# EAGLE design NodeIrTranceiver.v1.cg2 (EAGLE 4.11)
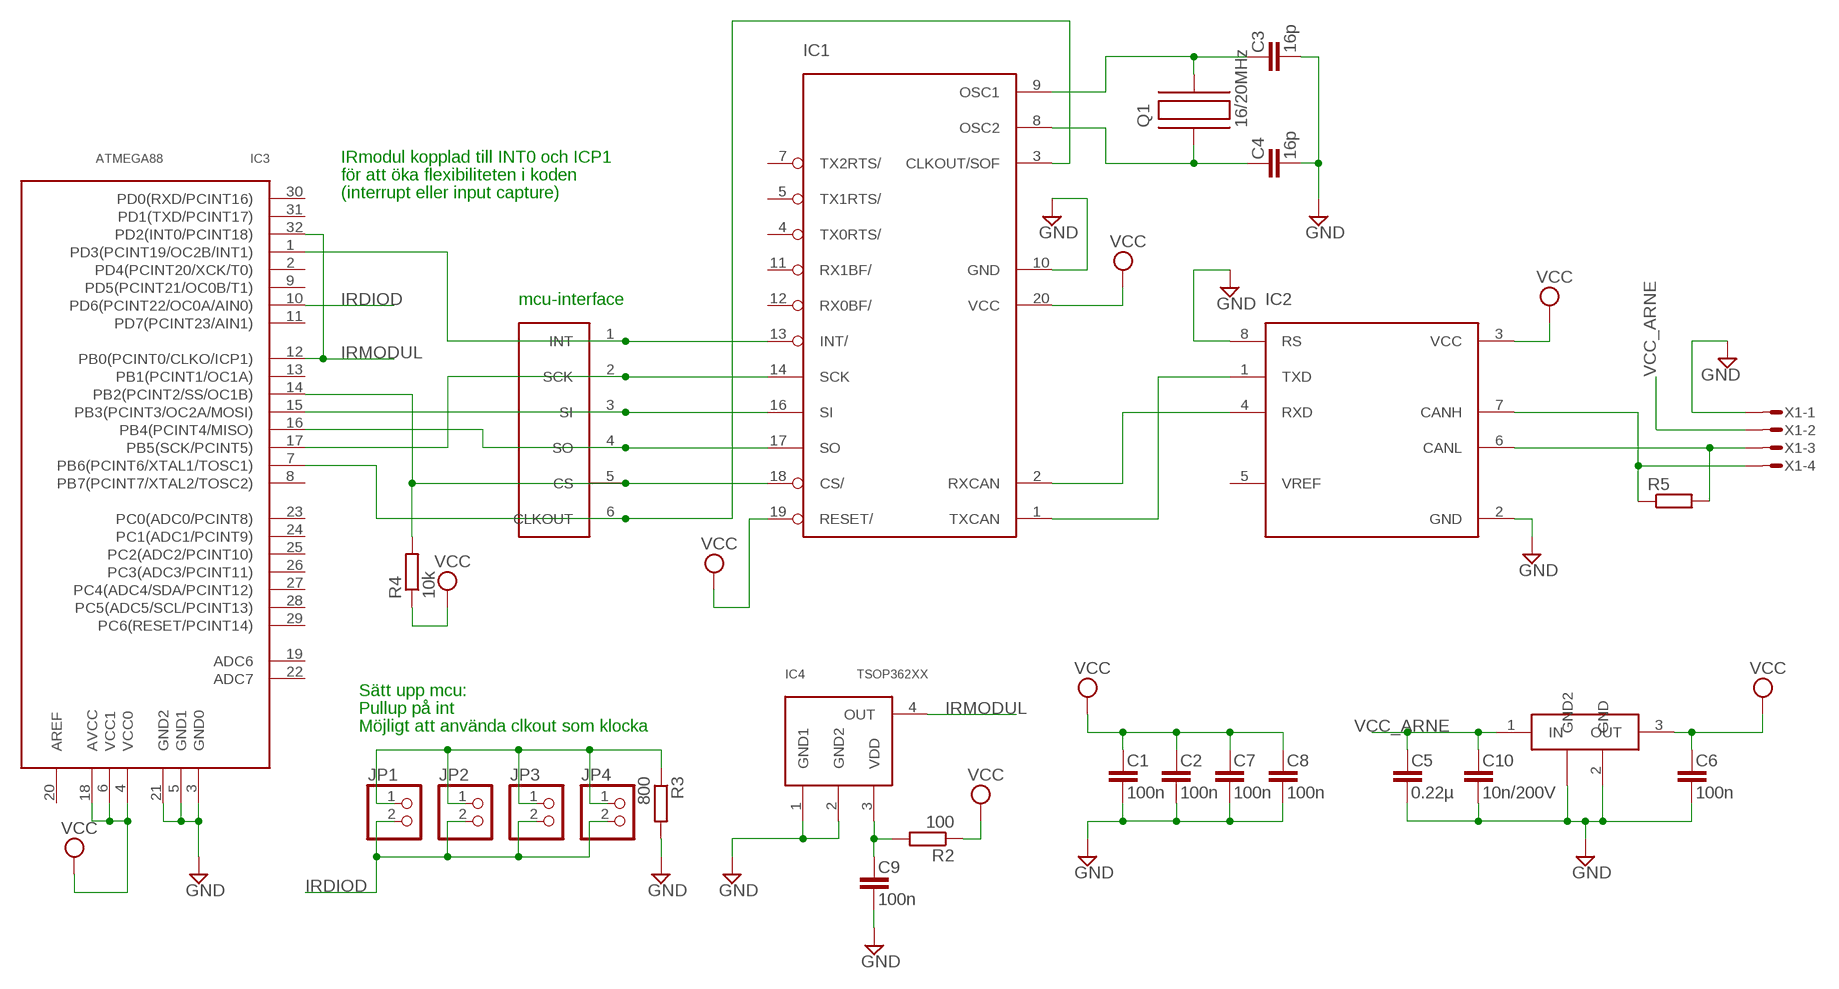
[diagram p0: schematic, sheet 1]

## Parts
C1  100n  C-EU  [C0603]
C2  100n  C-EU  [C0603]
C3  16p  C-EU  [C0603]
C4  16p  C-EU  [C0603]
C5  0.22µ  C-EU  [C0603]
C6  100n  C-EU  [C0603]
C7  100n  C-EU  [C0603]
C8  100n  C-EU  [C0603]
C9  100n  C-EU  [C0603]
C10  10n/200V  C-EU  [C0603]
IC1  MCP2515  [TSSOP]
IC2  MCP2551  [TSSOP]
IC3  ATMEGA88  [TQFP32]
IC4  TSOP362XX  [SMD]
IC5  LM340MP-5.0  [SOT223]
JP1  PINHD-1X2  [1X02]
JP2  PINHD-1X2  [1X02]
JP3  PINHD-1X2  [1X02]
JP4  PINHD-1X2  [1X02]
Q1  16/20MHz  C-MAC-LFA147E  [SMD]
R2  100  R-EU_R0603  [R0603@1]
R3  800  R-EU_R0603  [R0603@1]
R4  10k  R-EUR0603  [R0603]
R5  R-EUR0603  [R0603]
U$1  CAN-INTERFACE  [VIA-LIST]
X1  MICROMATCH-4  [MICROMATCH-4-SMD]

## Nets
CANH: IC2.7(CANH) R5.1 X1.4
GND: C1.2 C2.2 C3.2 C4.2 C5.2 C6.2 C7.2 C8.2 C9.2 C10.2 IC1.10(GND) IC2.2(GND) IC2.8(RS) IC3.3(GND0) IC3.5(GND1) IC3.21(GND2) IC4.1(GND1) IC4.2(GND2) IC5.2(GND) IC5.4(GND2) R3.2 X1.1
IRDIOD: IC3.10(PD6(PCINT22/OC0A/AIN0)) JP1.2 JP2.2 JP3.2 JP4.2
IRMODUL: IC3.12(PB0(PCINT0/CLKO/ICP1)) IC3.32(PD2(INT0/PCINT18)) IC4.4(OUT)
N$1: IC1.2(RXCAN) IC2.4(RXD)
N$2: IC1.1(TXCAN) IC2.1(TXD)
N$3: JP1.1 JP2.1 JP3.1 JP4.1 R3.1
N$4: IC1.13(INT/) IC3.1(PD3(PCINT19/OC2B/INT1)) U$1.1(INT)
N$5: IC2.6(CANL) R5.2 X1.3
N$12: C3.1 IC1.9(OSC1) Q1.P$2
N$13: C4.1 IC1.8(OSC2) Q1.P$1
N$20: IC1.14(SCK) IC3.17(PB5(SCK/PCINT5)) U$1.2(SCK)
N$21: IC1.16(SI) IC3.15(PB3(PCINT3/OC2A/MOSI)) U$1.3(SI)
N$22: IC1.17(SO) IC3.16(PB4(PCINT4/MISO)) U$1.4(SO)
N$23: IC1.3(CLKOUT/SOF) IC3.7(PB6(PCINT6/XTAL1/TOSC1)) U$1.6(CLKOUT)
N$29: IC1.18(CS/) IC3.14(PB2(PCINT2/SS/OC1B)) R4.2 U$1.5(CS)
VCC: C1.1 C2.1 C6.1 C7.1 C8.1 IC1.19(RESET/) IC1.20(VCC) IC2.3(VCC) IC3.4(VCC0) IC3.6(VCC1) IC3.18(AVCC) IC5.3(OUT) R2.1 R4.1
VCC_ARNE: C5.1 C10.1 IC5.1(IN) X1.2
VDD: C9.1 IC4.3(VDD) R2.2
Unconnected: IC1.4(TX0RTS/) IC1.5(TX1RTS/) IC1.7(TX2RTS/) IC1.11(RX1BF/) IC1.12(RX0BF/) IC2.5(VREF) IC3.2(PD4(PCINT20/XCK/T0)) IC3.8(PB7(PCINT7/XTAL2/TOSC2)) IC3.9(PD5(PCINT21/OC0B/T1)) IC3.11(PD7(PCINT23/AIN1)) IC3.13(PB1(PCINT1/OC1A)) IC3.19(ADC6) IC3.20(AREF) IC3.22(ADC7) IC3.23(PC0(ADC0/PCINT8)) IC3.24(PC1(ADC1/PCINT9)) IC3.25(PC2(ADC2/PCINT10)) IC3.26(PC3(ADC3/PCINT11)) IC3.27(PC4(ADC4/SDA/PCINT12)) IC3.28(PC5(ADC5/SCL/PCINT13)) IC3.29(PC6(RESET/PCINT14)) IC3.30(PD0(RXD/PCINT16)) IC3.31(PD1(TXD/PCINT17))

## Notes on the sheet
- IRmodul kopplad till INT0 och ICP1
- för att öka flexibiliteten i koden
- (interrupt eller input capture)
- mcu-interface
- Sätt upp mcu:
- Pullup på int
- Möjligt att använda clkout som klocka

## Library data of the parts
C1-C10 = rcl:C-EU
IC1 = mcp2515:MCP2515
IC2 = mcp2551:MCP2551
IC3 = atmega88:ATMEGA88
IC4 = tsop362xx:TSOP362XX
IC5 = lm340mp:LM340MP-5.0
JP1-JP4 = pinhead-mm:PINHD-1X2: PIN HEADER
Q1 = hc49-4h-smx:C-MAC-LFA147E
R2 R3 = rcl:R-EU_: RESISTOR, European symbol
R4 R5 = rcl:R-EU
U$1 = can-interface:CAN-INTERFACE
X1 = micromatch-smd:MICROMATCH-4: MicroMaTch 4 7-215464-4 / 0-215464-4 Drawing Number C-215464 DDEController.pdf

## Board
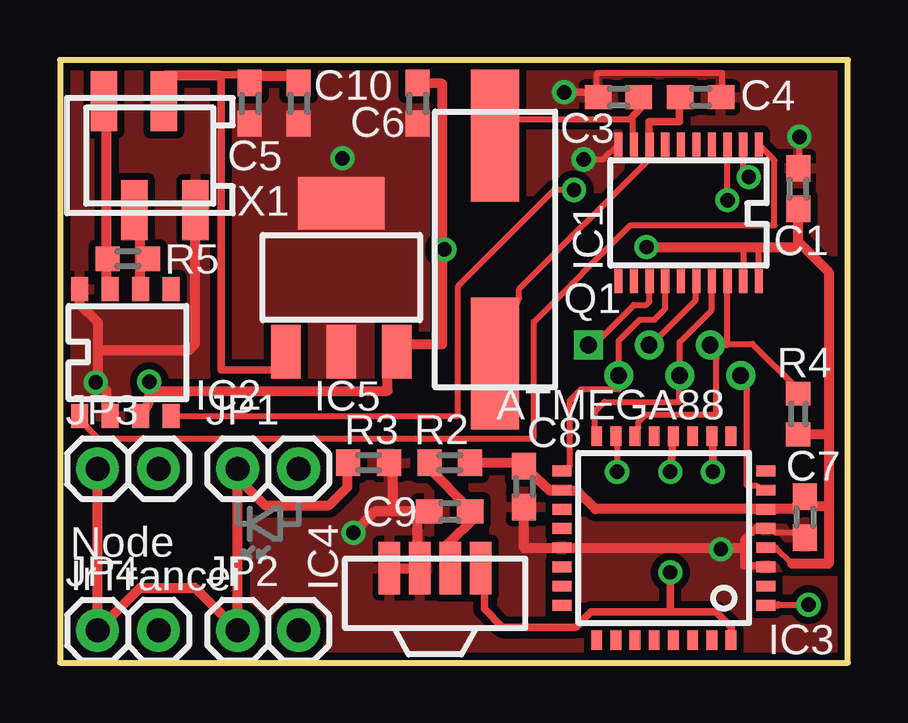
[diagram p1: board, top side]
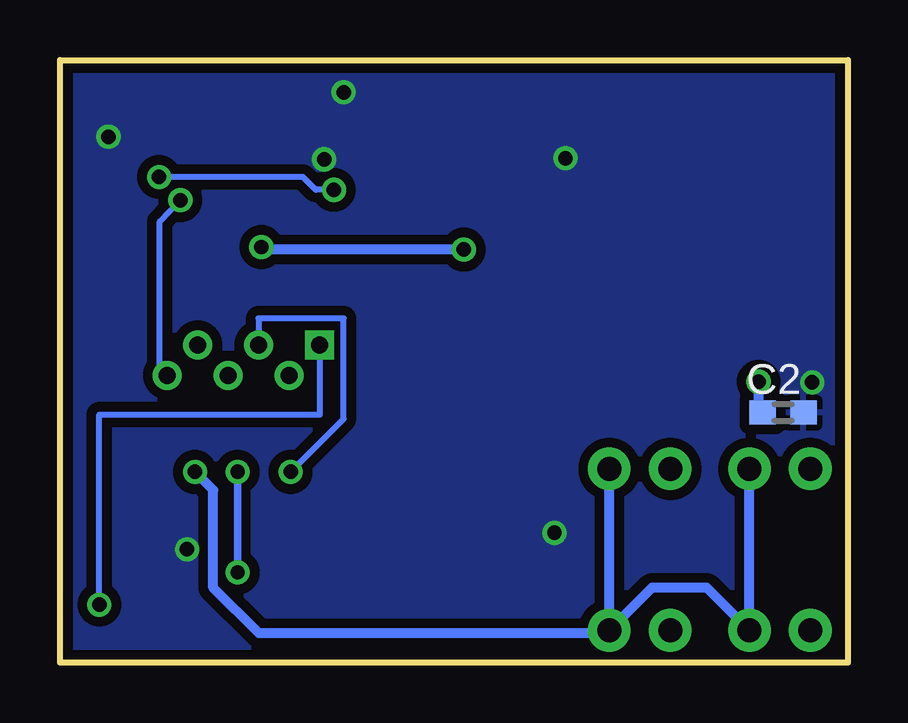
[diagram p2: board, bottom side, seen from below]

Size 32.85 x 25.13 mm. Coordinates in mm from the lower left corner, seen from the top.
Outline: 0,0 32.85,0 32.85,25.13 0,25.13 0,0
Copper layers (1*16): Top 0.035mm / dielectric 1.5mm / Bottom 0.035mm
Design rules "10mils, 0.6drill": minimum track width 10mil, minimum drill 0.6mm, track to track 10mil, track to pad 10mil, pad to pad 10mil, via to via 10mil, smd to smd 10mil, copper to edge 10mil, drill to drill 10mil, minimum pad ring 10mil, minimum via ring 8mil, stop-mask expansion 0mil, vias tented up to drill 0mil, thermal gap 10mil

### Footprints (pad centres in the part's own frame; a part is rotated, then mirrored left to right if it is on the bottom)
C0603 = smd 1.1 x 1: 1 -0.85,0; 2 0.85,0
TSSOP = smd 0.34 x 1: 1 -2.925,-2.85; 2 -2.275,-2.85; 3 -1.625,-2.85; 4 -0.975,-2.85; 5 -0.325,-2.85; 6 0.325,-2.85; 7 0.975,-2.85; 8 1.625,-2.85; 9 2.275,-2.85; 10 2.925,-2.85; 11 2.925,2.85; 12 2.275,2.85; 13 1.625,2.85; 14 0.975,2.85; 15 0.325,2.85; 16 -0.325,2.85; 17 -0.975,2.85; 18 -1.625,2.85; 19 -2.275,2.85; 20 -2.925,2.85
TSSOP' = smd 0.7 x 1: 1 -1.981,-2.645; 2 -0.711,-2.645; 3 0.559,-2.645; 4 1.829,-2.645; 5 1.829,2.645; 6 0.559,2.645; 7 -0.711,2.645; 8 -1.981,2.645
TQFP32 = smd 0.8 x 0.45: 1 -4.25,2.65; 2 -4.25,1.85; 3 -4.25,1.05; 4 -4.25,0.25; 5 -4.25,-0.55; 6 -4.25,-1.35; 7 -4.25,-2.15; 8 -4.25,-2.95; 17 4.25,-2.95; 18 4.25,-2.15; 19 4.25,-1.35; 20 4.25,-0.55; 21 4.25,0.25; 22 4.25,1.05; 23 4.25,1.85; 24 4.25,2.65 | smd 0.45 x 0.8: 9 -2.8,-4.4; 10 -2,-4.4; 11 -1.2,-4.4; 12 -0.4,-4.4; 13 0.4,-4.4; 14 1.2,-4.4; 15 2,-4.4; 16 2.8,-4.4; 25 2.8,4.1; 26 2,4.1; 27 1.2,4.1; 28 0.4,4.1; 29 -0.4,4.1; 30 -1.2,4.1; 31 -2,4.1; 32 -2.8,4.1
SMD = smd 0.9 x 2.2: 1 -1.905,0; 2 -0.635,0; 3 0.635,0; 4 1.905,0
SOT223 = smd 1.219 x 2.235: 1 -2.311,-3.099; 2 0,-3.099; 3 2.311,-3.099 | smd 3.6 x 2.2: 4 0,3.099
1X02 = drill 1 pad 1.778 round: 1 -1.27,0; 2 1.27,0
SMD' = smd 5.5 x 2: P$1 4.75,0; P$2 -4.75,0
R0603@1 = smd 1 x 1.1: 1 -0.85,0; 2 0.85,0
R0603 = smd 0.991 x 1.016: 1 -0.85,0; 2 0.85,0
VIA-LIST = drill 0.7 square: 1 0,2.54 | drill 0.7 round: 2 -1.27,1.27; 3 0,0; 4 -1.27,-1.27; 5 0,-2.54; 6 -1.27,-3.81
MICROMATCH-4-SMD = smd 1.1 x 2.5: 1 1.905,-2.272; 2 0.585,2.272; 3 -0.635,-2.272; 4 -1.905,2.272

### Placement (x,y rotation side)
C1  30.78,19.76 90 top
C2  2.7,10.42 0 bottom
C3  23.28,23.57 180 top
C4  26.71,23.57 0 top
C5  7.92,23.32 270 top
C6  14.9,23.32 270 top
C7  31.04,6.06 270 top
C8  19.34,7.33 270 top
C9  16.25,6.3 180 top
C10  9.95,23.32 270 top
IC1  26.21,18.75 180 top
IC2  MCP2551  [TSSOP']  2.8,12.92 0 top
IC3  25.17,5.04 180 top
IC4  15.64,3.94 0 top
IC5  11.73,16.05 0 top
JP1  8.68,8.08 0 top
JP2  8.68,1.35 0 top
JP3  2.84,8.08 0 top
JP4  2.84,1.35 0 top
Q1  16/20MHz  [SMD']  18.14,17.23 270 top
R2  16.25,8.33 180 top
R3  12.87,8.33 0 top
R4  30.78,10.36 90 top
R5  2.84,16.84 0 top
U$1  24.57,13.24 90 top
X1  3.75,21.13 0 top

### Tracks (layer width: path | path; a pad name or v marks a point on that pad's centre or on a via)
CANH
  Top 0.254: 1.95,16.71 1.95,16.84 R5.1 | IC2.7 1.95,15.57 1.95,15.7
  Top 0.406: X1.4 1.95,22.79 1.95,16.71 1.95,15.7 2.07,15.59 IC2.7
GND  (via drill 0.6)
  Top 0.254: v21.84,20.98 22.65,20.98 IC1.10 | v30.83,21.92 30.83,21.06 C1.2 | 1.59,11.69 v1.49,11.69 | 20.62,4.78 IC3.21 21.28,4.78 | 29.05,4.04 IC3.3 | 29.05,5.64 IC3.5 29.81,5.44 30.57,5.44 C7.2 | 27.27,4.78 v27.55,4.73 | C3.2 22.39,23.58 22.39,24.59 27.6,24.59 27.6,23.61 | 27.6,23.61 27.6,23.57 | 27.6,23.61 C4.2
  Top 0.305: IC2.2 1.95,10.72 | C3.2 22.15,23.77 v21.02,23.77 | 29.05,4.04 28.51,4.04 28.51,4.78 28.51,5.11 29.05,5.64
  Top 0.406: 1.95,10.72 1.95,11.33 1.59,11.69 1.59,13.03 | 1.59,13.03 1.59,14.17 0.83,14.94 IC2.8 | 20.62,4.78 19.35,4.78 C8.2 | 21.28,4.78 27.27,4.78 28.51,4.78 | IC4.1 13.73,4.12 13.76,4.14 13.83,3.94 IC4.2 14.9,4.06 14.9,6.33 C9.2 13.88,6.3 | R3.2 13.88,8.33 13.88,6.3 | 13.88,6.3 13.12,6.3 v12.23,5.41 | X1.1 5.63,17.99 5.63,13.29 5.38,13.03 1.59,13.03
  Bottom 0.305: v21.02,23.77 20.97,23.72
  other vias: 11.78,21.03
  pour Bottom (isolate 0.406): -0.01,25.15 32.83,25.15 32.83,-0.03 24.38,-0.03 -0.01,-0.03
  pour Top (isolate 0.305, no thermals): 6.83,24.53 15.89,24.53 15.89,11.47 6.83,11.47
  pour Top (isolate 0.305): -0.21,25.22 33.06,25.22 33.06,-0.18 -0.21,-0.18
IRDIOD  (via drill 0.6)
  Top 0.305: IC3.10 27.17,9.39 27.22,9.35 v27.22,7.95
  Bottom 0.406: v27.22,7.95 26.46,7.19 26.46,3.12 24.55,1.22 10.07,1.22 JP2.2 | JP2.2 JP1.2 | JP2.2 8.17,3.12 5.88,3.12 JP4.2 JP3.2
IRMODUL  (via drill 0.6)
  Top 0.305: IC4.4 17.54,3.66 17.7,3.51 17.7,2.24 18.46,1.47 21.5,1.47 22.14,2.11 25.44,2.11 | IC3.32 27.97,0.96 27.98,0.97 27.98,1.47 27.35,2.11 25.44,2.11 | 25.44,2.11 v25.44,3.76 | IC3.12 25.57,9.35 v25.44,7.95
  Bottom 0.305: v25.44,3.76 v25.44,7.95
N$1  (via drill 0.6)
  Top 0.254: v21.43,19.71 20.62,19.71 16.6,15.7 16.6,10.29 4.94,10.29 IC2.4 | v28.72,20.24 28.49,20.47 IC1.2
  Bottom 0.254: v21.43,19.71 22.19,19.71 22.72,20.24 v28.72,20.24
N$2
  Top 0.254: IC2.1 1.13,9.8 1.59,9.35 19.75,9.35 19.75,14.2 23.79,18.24 29.79,18.24 29.79,20.95 IC1.1
N$3
  Top 0.406: R3.1 11.98,8.33 11.98,7.32 11.22,6.55 8.55,6.55 7.41,7.7 JP1.1 JP2.1 5.63,3.12 3.34,3.12 JP4.1 JP3.1
N$4  (via drill 0.6)
  Top 0.254: U$1.1 22.25,13.24 23.92,14.91 24.43,14.91 24.58,15.06 24.58,15.77 24.58,15.78 IC1.13 | 29.94,2.41 v31.21,2.41
  Top 0.305: IC3.1 29.94,2.41
  Bottom 0.254: v31.21,2.41 31.21,10.34 22.01,10.34 22.01,13.16 22.02,13.17 U$1.1
N$5
  Top 0.254: R5.2 3.34,16.84 3.34,16.71 3.34,15.57 IC2.6
  Top 0.406: IC2.6 3.34,15.59 3.34,16.71 3.34,17.99 X1.3
N$12
  Top 0.254: IC1.9 23.87,22.07 23.87,22.66 23.79,22.66 19.14,22.66 Q1.P$2
  Top 0.305: C3.1 24.17,23.1 23.79,22.66
N$13
  Top 0.254: IC1.8 24.53,21.11 24.53,20.96 19.14,15.57 19.14,15.19 Q1.P$1
  Top 0.305: IC1.8 24.55,21.6 24.55,22.05 24.55,22.56 25.82,22.56 25.82,23.57 C4.1
N$20
  Top 0.254: IC1.14 25.23,15.87 25.19,15.83 25.24,15.77 25.24,14.76 24.78,14.3 24.17,14.3 23.29,13.42 U$1.2 23.29,11.9 23.31,11.41 21.73,11.41 21.25,10.92 21.25,8.18 IC3.17
N$21  (via drill 0.6)
  Top 0.254: U$1.3 24.64,13.24 26.51,15.11 26.51,15.88 IC1.16 | v23.23,7.95 23.23,9.04 IC3.15
  Bottom 0.254: v23.23,7.95 21.02,10.16 21.02,14.35 24.58,14.35 24.58,13.84 U$1.3
N$22
  Top 0.254: IC1.17 27.18,15.84 27.17,15.83 27.17,14.71 25.84,13.37 U$1.4 25.84,11.9 25.82,10.87 22.7,10.87 22.29,10.47 22.29,9.75 IC3.16
N$23  (via drill 0.6)
  Top 0.254: v27.83,19.28 27.83,21.11 IC1.3 | IC3.7 29.05,7.37 28.64,7.37 28.64,11.41 U$1.6
  Bottom 0.254: v27.83,19.28 28.69,18.39 28.69,12.29 U$1.6
N$29
  Top 0.254: IC1.18 27.83,13.29 | 27.83,13.29 27.83,13.24 U$1.5 27.37,12.67 27.37,10.34 24.43,10.34 24.12,10.03 24.12,9.8 IC3.14 | R4.2 30.78,11.38 28.87,13.29 27.83,13.29
VCC  (via drill 0.6)
  Top 0.254: 3.73,11.25 3.78,11.33 | 29.81,6.4 IC3.6 29.05,6.4 | 21.28,7.16 IC3.18 | IC3.4 29.85,4.79 30.52,4.12 | IC1.20 29.12,17.32 29.68,17.32 | IC1.19 28.48,15.83 28.49,15.83 28.49,17.32 28.49,17.35
  Top 0.305: 13.66,12.09 IC5.3
  Top 0.406: C6.1 15.95,24.13 15.95,17.35 | 15.95,17.35 15.95,13.27 14.08,13.27 14.08,13.21 IC5.3 | 3.78,11.33 13.66,11.33 13.66,12.09 | IC2.3 3.67,10.77 3.73,11.25 v3.73,11.71 | 15.95,17.35 v16.02,17.22 | v24.45,17.32 28.49,17.32 29.68,17.32 | 29.68,17.32 | IC3.18 20.69,7.16 20.44,7.16 C8.1 18.96,8.33 R2.1 | 30.52,4.12 32.05,4.12 32.05,6.5 | 32.05,6.5 31.41,6.5 C7.1 30.57,6.4 29.81,6.4 | 21.28,7.16 21.56,7.16 22.32,6.4 29.05,6.4 | 32.05,9.48 32.05,16.28 30.78,17.55 30.78,17.6 | 32.05,9.48 32.05,6.5 | 30.78,17.6 30.78,17.35 30.75,17.32 29.68,17.32 | 30.78,17.6 C1.1 | R4.1 32.01,9.51 32.05,9.48
  Bottom 0.254: C2.1 3.73,10.92
  Bottom 0.406: 3.73,10.92 v3.73,11.71 | v24.45,17.32 24.4,17.32 24.3,17.22 v16.02,17.22
VCC_ARNE
  Top 0.305: C5.1 7.84,24.51 6.72,24.51 6.72,24.46 6.72,12.19 9.31,12.19 9.31,12.95 | 9.31,12.95 9.31,13.03 | 9.31,12.95 IC5.1
  Top 0.406: C10.1 9.95,24.46 7.92,24.46 C5.1 7.92,24.21 | X1.2 4.37,24.46 6.72,24.46
VDD
  Top 0.406: 17.31,6.07 C9.1 | 17.31,6.07 16.17,4.95 IC4.3 | 17.31,6.07 16.93,6.55 15.52,7.96 R2.2

### Text on the board
tNames: Node | IrTrancei